# EAGLE design M2 (EAGLE 6.5.0)
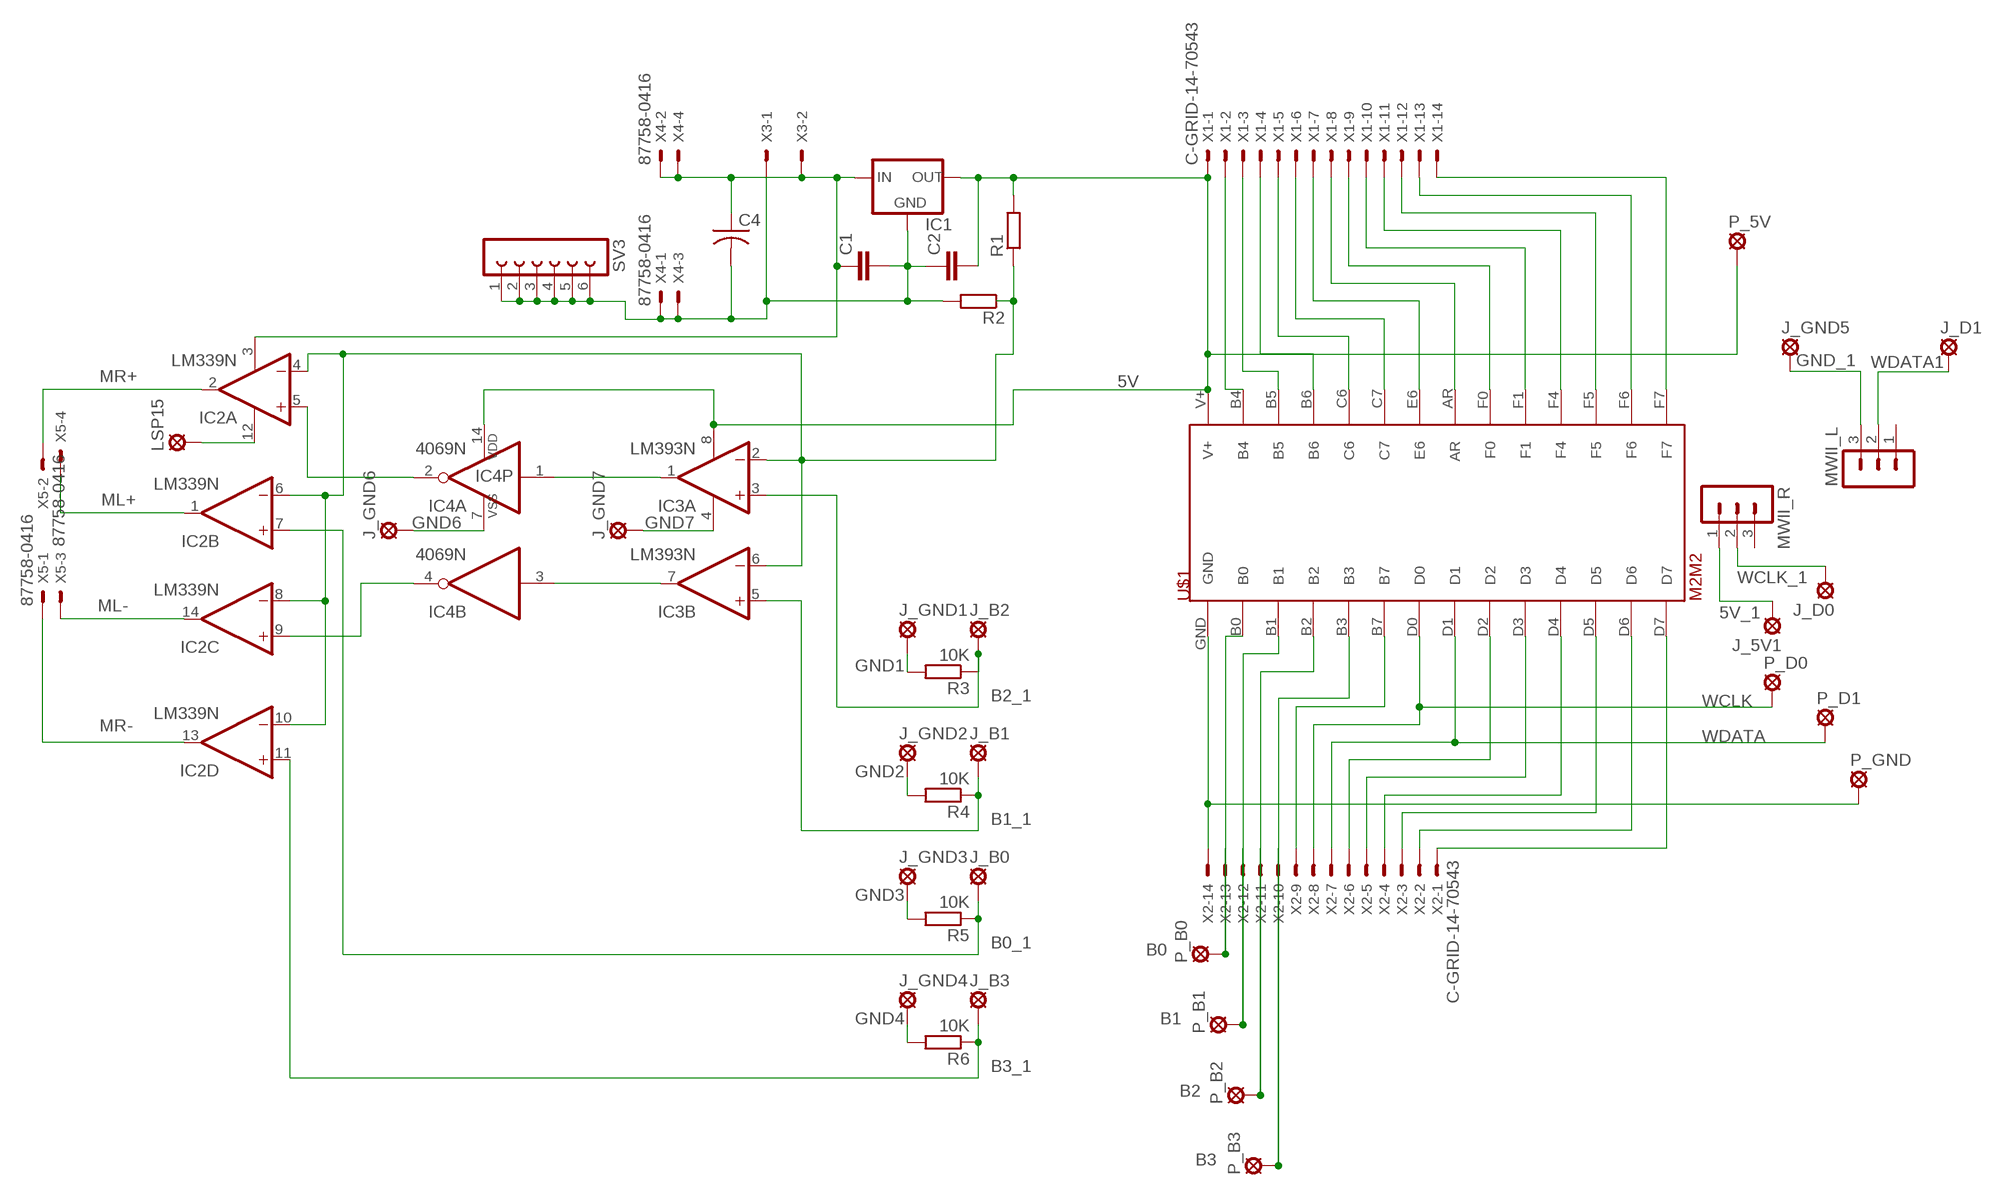
[diagram p0: schematic, sheet 1]

## Parts
C1  C2,5-3  [C2.5-3]
C2  C2,5-3  [C2.5-3]
C4  C-US050-025X075  [C050-025X075]
IC1  78MXXS  [78MXXS]
IC2  LM339N  [DIL14]
IC3  LM393N  [DIL08]
IC4  4069N  [DIL14]
J_5V1  LSP10  [LSP10]
J_B0  LSP10  [LSP10]
J_B1  LSP10  [LSP10]
J_B2  LSP10  [LSP10]
J_B3  LSP10  [LSP10]
J_D0  LSP10  [LSP10]
J_D1  LSP10  [LSP10]
J_GND1  LSP10  [LSP10]
J_GND2  LSP10  [LSP10]
J_GND3  LSP10  [LSP10]
J_GND4  LSP10  [LSP10]
J_GND5  LSP10  [LSP10]
J_GND6  LSP10  [LSP10]
J_GND7  LSP10  [LSP10]
LSP15  LSP10  [LSP10]
MWII_L  MA03-1  [MA03-1]
MWII_R  MA03-1  [MA03-1]
P_5V  LSP10  [LSP10]
P_B0  LSP10  [LSP10]
P_B1  LSP10  [LSP10]
P_B2  LSP10  [LSP10]
P_B3  LSP10  [LSP10]
P_D0  LSP10  [LSP10]
P_D1  LSP10  [LSP10]
P_GND  LSP10  [LSP10]
R1  R-EU_0204/7  [0204/7]
R2  R-EU_0204/7  [0204/7]
R3  10K  R-EU_0204/7  [0204/7]
R4  10K  R-EU_0204/7  [0204/7]
R5  10K  R-EU_0204/7  [0204/7]
R6  10K  R-EU_0204/7  [0204/7]
SV3  FE06-1  [FE06]
U$1  M2M2  [M2]
X1  C-GRID-14-70543  [70543-14]
X2  C-GRID-14-70543  [70543-14]
X3  KK-156-2  [KK-156-2]
X4  87758-0416  [87758-0416]
X5  87758-0416  [87758-0416]

## Nets
5V: C2.2 IC1.OUT IC3.8(P:V+) IC4.14(P:VDD) P_5V.MP R1.2 U$1.V+ X1.1
5V_1: J_5V1.MP MWII_R.1
B0 [POWER]: P_B0.MP U$1.B0 X2.13
B0_1 [POWER]: IC2.7(B:+IN) J_B0.MP R5.1
B1 [POWER]: P_B1.MP U$1.B1 X2.12
B1_1 [POWER]: IC3.5(B:+IN) J_B1.MP R4.1
B2 [POWER]: P_B2.MP U$1.B2 X2.11
B2_1 [POWER]: IC3.3(A:+IN) J_B2.MP R3.1
B3 [POWER]: P_B3.MP U$1.B3 X2.10
B3_1 [POWER]: IC2.11(D:+IN) J_B3.MP R6.1
GND1: J_GND1.MP R3.2
GND2: J_GND2.MP R4.2
GND3: J_GND3.MP R5.2
GND4: J_GND4.MP R6.2
GND6: IC4.7(P:VSS) J_GND6.MP
GND7: IC3.4(P:V-) J_GND7.MP
GND_1: J_GND5.MP MWII_L.3
ML+: IC2.1(B:OUT) X5.4
ML-: IC2.14(C:OUT) X5.3
MR+: IC2.2(A:OUT) X5.2
MR-: IC2.13(D:OUT) X5.1
N$2: U$1.B4 X1.2
N$3: U$1.B5 X1.3
N$4: U$1.B6 X1.4
N$5: U$1.C6 X1.5
N$6: U$1.C7 X1.6
N$7: U$1.E6 X1.7
N$8: U$1.AR X1.8
N$9: U$1.F0 X1.9
N$10: U$1.F1 X1.10
N$11: U$1.F4 X1.11
N$12: U$1.F5 X1.12
N$13: U$1.F6 X1.13
N$15: U$1.F7 X1.14
N$16: IC2.4(A:-IN) IC2.6(B:-IN) IC2.8(C:-IN) IC2.10(D:-IN) IC3.2(A:-IN) IC3.6(B:-IN) R1.1 R2.1
N$17 [POWER]: P_GND.MP U$1.GND X2.14
N$21: U$1.B7 X2.9
N$24: U$1.D2 X2.6
N$25: U$1.D3 X2.5
N$26: U$1.D4 X2.4
N$27: U$1.D5 X2.3
N$28: U$1.D6 X2.2
N$29: U$1.D7 X2.1
N$30: IC3.1(A:OUT) IC4.1(A:I)
N$31: IC3.7(B:OUT) IC4.3(B:I)
N$33: IC2.5(A:+IN) IC4.2(A:O)
N$34 [POWER]: C1.1 C4.1 IC1.IN IC2.3(P:V+) X3.2 X4.2 X4.4
N$36: IC2.9(C:+IN) IC4.4(B:O)
N$50: IC2.12(P:GND) LSP15.MP
N$51: C1.2 C2.1 C4.2 IC1.GND R2.2 SV3.1 SV3.2 SV3.3 SV3.4 SV3.5 SV3.6 X3.1 X4.1 X4.3
WCLK: P_D0.MP U$1.D0 X2.8
WCLK_1: J_D0.MP MWII_R.2
WDATA: P_D1.MP U$1.D1 X2.7
WDATA1: J_D1.MP MWII_L.2
Unconnected: IC4.5(C:I) IC4.6(C:O) IC4.8(D:O) IC4.9(D:I) IC4.10(E:O) IC4.11(E:I) IC4.12(F:O) IC4.13(F:I) MWII_L.1 MWII_R.3

## Library data of the parts
C1 C2 = capacitor-wima:C: CAPACITOR naming: grid - package width
C4 = rcl:C-US: CAPACITOR, American symbol
IC1 = v-reg:78MXXS: VOLTAGE REGULATOR
IC2 = linear:LM339: Low Power Low Offset Voltage Quad Comparators with open collector; LM139/LM239/LM339/LM2901/LM3302
IC3 = linear:LM393: COMPARATOR
IC4 = 40xx:4069: Hex INVERTER
J_5V1 J_B0 J_B1-J_B3 J_D0 J_D1 J_GND1-J_GND7 LSP15 P_5V P_B0 P_B1-P_B3 P_D0 P_D1 P_GND = solpad:LSP10: SOLDER PAD drill 1.0 mm, distributor Buerklin, 12H555
MWII_L MWII_R = con-lstb:MA03-1: PIN HEADER; OC_FARNELL: unknown; OC_NEWARK: unknown
R1-R6 = resistor:R-EU_: RESISTOR, European symbol
SV3 = con-lsta:FE06-1: FEMALE HEADER; OC_FARNELL: unknown; OC_NEWARK: unknown
U$1 = m2:M2
X1 X2 = con-molex:C-GRID-14: CONNECTOR wire to board 2.54 mm (0.100") pitch header; OC_FARNELL: unknown; OC_NEWARK: unknown
X3 = con-molex:KK-156-2: KK 156 HEADER Source: http://www.molex.com/pdm_docs/sd/026604100_sd.pdf; OC_FARNELL: unknown; OC_NEWARK: unknown
X4 X5 = con-molex:87758-0416: 4 Pin - 2mm Dual Row Single Wafer, Vertical T/H HDR Source: http://www.molex.com/pdm_docs/sd/877580616_sd.pdf; MF: FARNELL; MPN: 87758-0416; OC_FARNELL: 7472315; OC_NEWARK: 39K3681

## Net classes
0 default: width 0.406 mm, clearance 0.254 mm
1 POWER: width 0.61 mm, clearance 0.254 mm

## Board
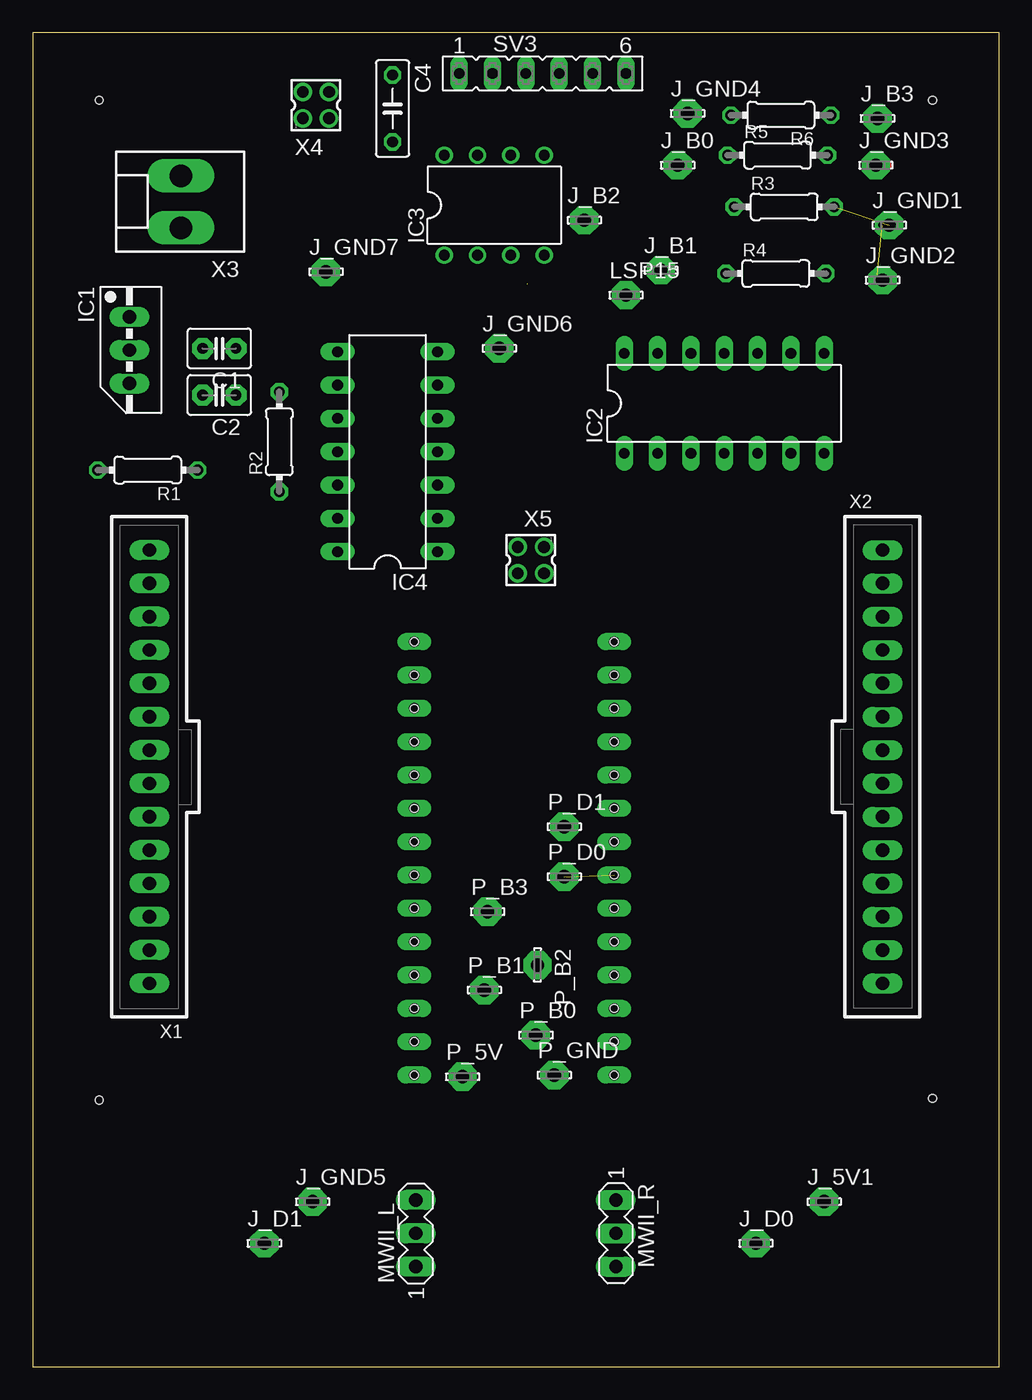
[diagram p1: board, top side]
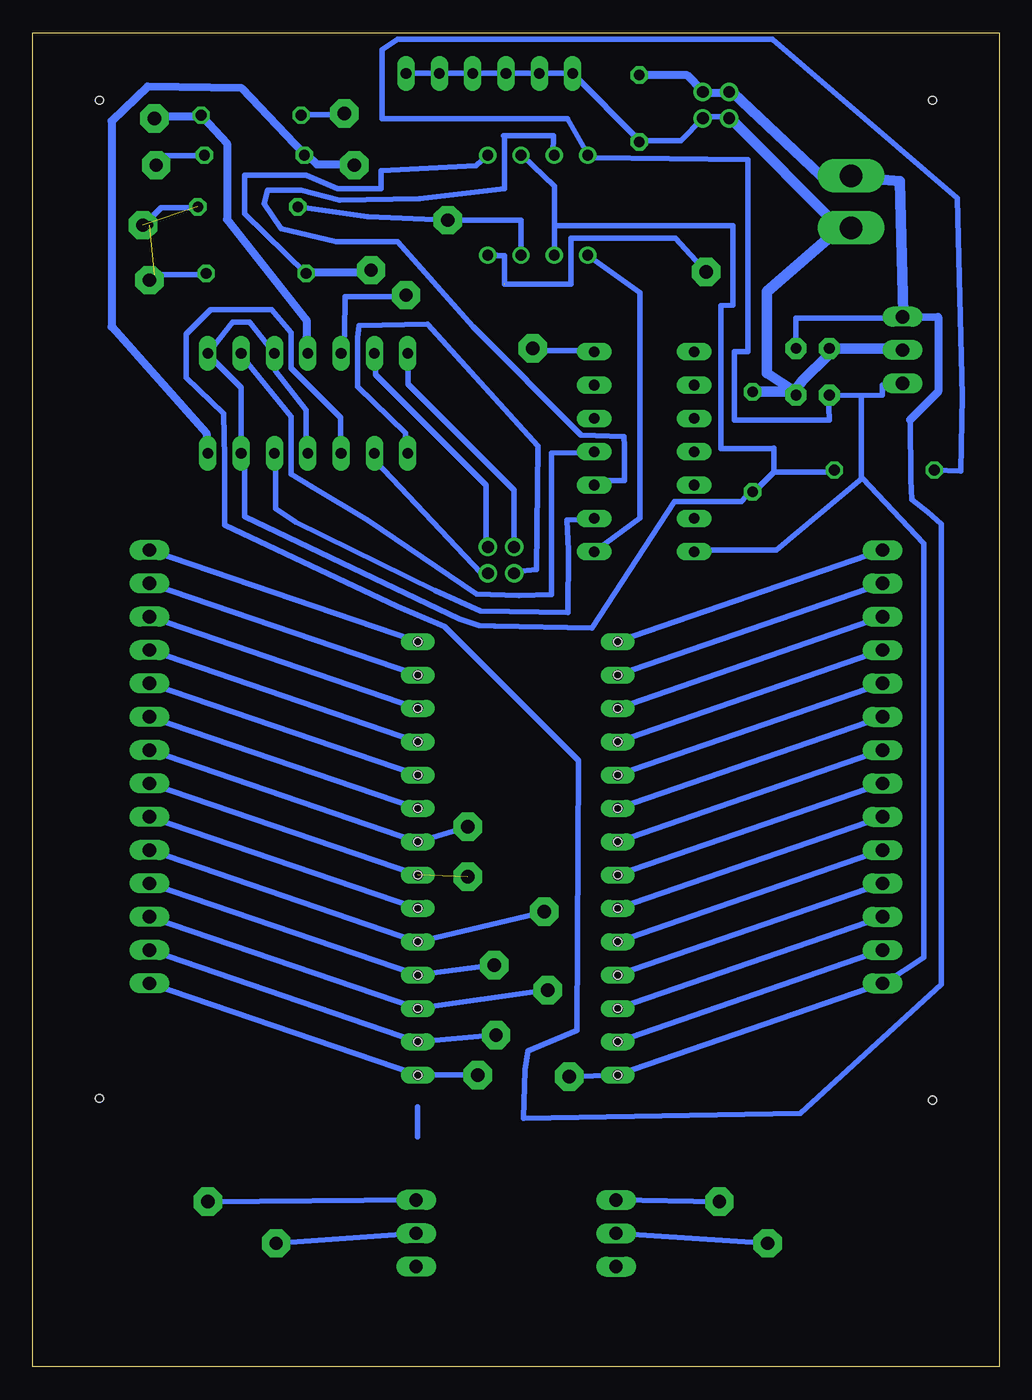
[diagram p2: board, bottom side, seen from below]

Size 73.65 x 101.65 mm. Coordinates in mm from the lower left corner, seen from the top.
Outline: 73.65,0 73.65,101.65 0,101.65 0,0 73.65,0
Copper layers (1*16): Top 0.035mm / dielectric 1.5mm / Bottom 0.035mm
Design rules "default": minimum track width 10mil, minimum drill 24mil, track to track 8mil, track to pad 8mil, pad to pad 8mil, via to via 8mil, smd to smd 8mil, copper to edge 40mil, drill to drill 8mil, minimum pad ring 10mil, minimum via ring 8mil, stop-mask expansion 4mil, vias tented up to drill 0mil, thermal gap 10mil
Holes 0.6 mm at 5.07,20.32 5.07,96.52 68.57,96.52 68.57,20.45

### Footprints (pad centres in the part's own frame; a part is rotated, then mirrored left to right if it is on the bottom)
C2.5-3 = drill 0.813 pad 1.6 octagon: 1 -1.27,0; 2 1.27,0
C050-025X075 = drill 0.813 octagon: 1 -2.54,0; 2 2.54,0
78MXXS = drill 1.016 long: GND 0,-2.54; IN -2.54,-2.54; OUT 2.54,-2.54
DIL14 = drill 0.813 long: 1 -7.62,-3.81; 2 -5.08,-3.81; 3 -2.54,-3.81; 4 0,-3.81; 5 2.54,-3.81; 6 5.08,-3.81; 7 7.62,-3.81; 8 7.62,3.81; 9 5.08,3.81; 10 2.54,3.81; 11 0,3.81; 12 -2.54,3.81; 13 -5.08,3.81; 14 -7.62,3.81
DIL08 = drill 0.813 pad 1.27: 1 -3.81,-3.81; 2 -1.27,-3.81; 3 1.27,-3.81; 4 3.81,-3.81; 5 3.81,3.81; 6 1.27,3.81; 7 -1.27,3.81; 8 -3.81,3.81
LSP10 = drill 1.016 pad 2.159 octagon: MP 0,0
MA03-1 = drill 1.016 long: 1 -2.54,0; 2 0,0; 3 2.54,0
0204/7 = drill 0.813 octagon: 1 -3.81,0; 2 3.81,0
FE06 = drill 0.813 long: 1 -6.35,0; 2 -3.81,0; 3 -1.27,0; 4 1.27,0; 5 3.81,0; 6 6.35,0
M2 = drill 0.8 long: AR 1.27,7.62; B0 -13.97,-7.62; B1 -11.43,-7.62; B2 -8.89,-7.62; B3 -6.35,-7.62; B4 -13.97,7.62; B5 -11.43,7.62; B6 -8.89,7.62; B7 -3.81,-7.62; C6 -6.35,7.62; C7 -3.81,7.62; D0 -1.27,-7.62; D1 1.27,-7.62; D2 3.81,-7.62; D3 6.35,-7.62; D4 8.89,-7.62; D5 11.43,-7.62; D6 13.97,-7.62; D7 16.51,-7.62; E6 -1.27,7.62; F0 3.81,7.62; F1 6.35,7.62; F4 8.89,7.62; F5 11.43,7.62; F6 13.97,7.62; F7 16.51,7.62; GND -16.51,-7.62; V+ -16.51,7.62 | hole 0.6: -13.97,7.62; -8.89,7.62; -6.35,7.62; 6.35,7.62; 8.89,7.62; 11.43,7.62; 13.97,7.62; 16.51,7.62; 16.51,-7.62; 13.97,-7.62; 11.43,-7.62; 8.89,-7.62; 6.35,-7.62; 3.81,-7.62; 1.27,-7.62; -1.27,-7.62; -3.81,-7.62; -6.35,-7.62; -8.89,-7.62; -11.43,-7.62; -13.97,-7.62; -16.51,-7.62; -16.51,7.62; -11.43,7.62; -3.81,7.62; -1.27,7.62; 1.27,7.62; 3.81,7.62
70543-14 = drill 1.016 long: 1 -16.51,0; 2 -13.97,0; 3 -11.43,0; 4 -8.89,0; 5 -6.35,0; 6 -3.81,0; 7 -1.27,0; 8 1.27,0; 9 3.81,0; 10 6.35,0; 11 8.89,0; 12 11.43,0; 13 13.97,0; 14 16.51,0
KK-156-2 = drill 1.7 pad 2.184 long: 1 -1.98,0; 2 1.98,0
87758-0416 = drill 0.9 pad 1.27: 1 -1,-1; 2 -1,1; 3 1,-1; 4 1,1

### Placement (x,y rotation side)
C1  14.21,77.6 180 top
C2  14.21,74.04 180 top
C4  27.42,95.89 270 top
IC1  9.9,77.47 270 top
IC2  52.7,73.41 0 top
IC3  35.17,88.52 0 top
IC4  27.04,69.72 90 top
J_5V1  60.32,12.57 0 top
J_B0  49.14,91.57 0 top
J_B1  47.87,83.57 0 top
J_B2  42.03,87.38 0 top
J_B3  64.38,95.12 0 top
J_D0  55.11,9.4 0 top
J_D1  17.64,9.4 0 top
J_GND1  65.27,87 0 top
J_GND2  64.76,82.8 0 top
J_GND3  64.25,91.57 0 top
J_GND4  49.9,95.5 0 top
J_GND5  21.33,12.57 0 top
J_GND6  35.55,77.6 0 top
J_GND7  22.34,83.44 0 top
LSP15  45.2,81.66 0 top
MWII_L  29.2,10.16 90 top
MWII_R  44.44,10.16 270 top
P_5V  32.76,22.1 0 top
P_B0  38.34,25.27 0 top
P_B1  34.41,28.7 0 top
P_B2  38.47,30.61 270 top
P_B3  34.66,34.67 0 top
P_D0  40.5,37.34 0 top
P_D1  40.5,41.15 0 top
P_GND  39.74,22.23 0 top
R1  8.75,68.33 180 top
R2  18.79,70.48 90 top
R3  57.27,88.39 0 top
R4  56.63,83.31 0 top
R5  56.76,92.33 0 top
R6  57.01,95.38 180 top
SV3  38.85,98.55 0 top
U$1  36.69,38.73 90 top
X1  8.88,45.72 90 top
X2  64.76,45.72 270 top
X3  11.29,88.77 90 top
X4  21.58,96.14 0 top
X5  37.96,61.47 180 top

### Tracks (layer width: path | path; a pad name or v marks a point on that pad's centre or on a via)
5V
  Bottom 0.406: P_5V.MP U$1.V+ X1.1 8.74,29.22 5.74,31.2 5.74,62.74 10.44,67.73 | 10.44,67.73 10.49,67.7 10.49,74 | 10.44,67.73 16.99,62.24 23.1,62.24 IC4.14 | 10.49,74 C2.2 13.03,73.97 12.93,72.19 12.93,72.14 20.18,72.14 20.18,77.34 19.17,77.34 19.17,92 19.22,92 31.03,92.13 31.19,92.29 IC3.8 31.36,92.46 32.88,95.12 47.02,95.12 47.02,100.36 45.85,101.14 17.29,101.14 3.18,89.06 2.8,73.97 2.91,68.26 R1.2 | IC1.OUT 7.42,74.79 8.9,74.79 8.9,74.05 10.49,74
5V_1
  Bottom 0.406: MWII_R.1 J_5V1.MP
B0
  Bottom 0.406: P_B0.MP U$1.B0 X2.13
B0_1
  Bottom 0.61: IC2.7 60.42,69.67 60.42,71.12 67.66,79.25 67.66,94.93 64.91,97.55 57.7,97.42 52.99,92.46 R5.1 52.66,92.29 52,91.63 49.19,91.63 J_B0.MP
B1
  Bottom 0.406: P_B1.MP U$1.B1 X2.12
B1_1
  Bottom 0.406: IC3.5 39.88,91.53 47.11,91.15 47.11,89.79 50.41,89.79 52.82,90.81 57.52,90.81 57.52,87.88 R4.1
  Bottom 0.61: 47.87,83.54 J_B1.MP 48.03,83.38 52.82,83.38 R4.1
B2
  Bottom 0.406: P_B2.MP U$1.B2 X2.11
B2_1
  Bottom 0.406: IC3.3 36.44,87.38 J_B2.MP 48.12,87.63 R3.1
  Bottom 0.61: 53.32,88.33 R3.1
B3
  Bottom 0.406: P_B3.MP U$1.B3 X2.10
B3_1
  Bottom 0.61: IC2.11 52.82,77.27 52.8,79.76 58.85,87.44 58.85,93.22 60.75,95.26 R6.1 61.08,95.26 64.38,95.26 J_B3.MP
GND1  (1 unrouted)
GND2  (via drill 0.6)  (1 unrouted)
  Bottom 0.406: 61.08,88.33 63.88,88.33 65.2,87.01 v64.76,87.01 | R4.2 60.58,83.21 64.38,83.21 64.71,82.88 J_GND2.MP
GND3
  Top 0.406: J_GND3.MP 65.27,91.57
  Bottom 0.406: R5.2 60.58,92.29 63.55,92.29 64.21,91.63 J_GND3.MP
GND4
  Top 0.406: 49.9,94.87 J_GND4.MP
  Bottom 0.406: R6.2 53.15,95.43 50.02,95.43 J_GND4.MP
GND6
  Bottom 0.406: IC4.7 30.86,77.43 35.32,77.43 35.49,77.6 J_GND6.MP
GND7  (1 unrouted)
  Bottom 0.406: J_GND7.MP 24.67,86.02 32.62,86.02 32.62,82.49 37.71,82.49 | IC3.4 38.95,84.7 38.29,84.7 38.29,84.68 37.68,84.68 37.68,82.55 37.71,82.55
GND_1
  Bottom 0.406: J_GND5.MP MWII_L.3
ML+
  Bottom 0.406: IC2.1 45.23,69.67 45.23,71.16 48.89,74.69 48.89,78.41 48.8,79.34 43.55,79.46 35.14,70.17 35.27,60.73 36.81,60.59 X5.4
ML-
  Bottom 0.406: IC2.14 45.06,77.1 45.06,74.88 36.97,66.79 36.97,62.57 X5.3
MR+
  Bottom 0.406: IC2.2 47.54,69.51 47.54,69.01 39.5,60.47 X5.2
MR-
  Bottom 0.406: IC2.13 47.54,77.1 47.54,75.6 39.12,67.18 39.12,62.57 X5.1
N$2
  Bottom 0.406: U$1.B4 X1.2
N$3
  Bottom 0.406: X1.3 U$1.B5
N$4
  Bottom 0.406: X1.4 U$1.B6
N$5
  Bottom 0.406: X1.5 U$1.C6
N$6
  Bottom 0.406: U$1.C7 X1.6
N$7
  Bottom 0.406: X1.7 U$1.E6
N$8
  Bottom 0.406: U$1.AR X1.8
N$9
  Bottom 0.406: X1.9 U$1.F0
N$10
  Bottom 0.406: U$1.F1 X1.10
N$11
  Bottom 0.406: X1.11 U$1.F4
N$12
  Bottom 0.406: U$1.F5 X1.12
N$13
  Bottom 0.406: X1.13 U$1.F6
N$15
  Bottom 0.406: U$1.F7 X1.14
N$16
  Bottom 0.406: IC2.4 52.82,69.67 52.82,72.91 55.13,75.86 55.13,77.1 IC2.10 55.3,77.27 57.12,79.59 58.44,79.59 60.25,77.27 IC2.8 60.25,77.1 57.77,74.62 IC2.6 57.48,68.75 57.52,68.75 57.52,64.77 41.14,56.97 39.64,56.46 38.46,56.43 31.04,56.3 24.73,65.91 19.64,65.91 18.98,66.7 R2.1 18.65,66.7 17.16,68.19 | 17.16,68.19 12.7,68.19 R1.1 | 34,84.86 IC3.2 33.9,86.97 33.89,86.97 | IC3.6 36.31,92.29 33.87,89.98 33.89,89.98 33.89,86.97 | 17.16,70 17.16,69.98 | 17.16,69.98 17.16,68.19 | 17.16,69.98 21.2,69.98 21.2,80.87 20.31,80.9 20.31,86.97 33.89,86.97
N$17
  Bottom 0.406: P_GND.MP U$1.GND X2.14
N$21
  Bottom 0.406: U$1.B7 X2.9
N$24
  Bottom 0.406: X2.6 U$1.D2
N$25
  Bottom 0.406: U$1.D3 X2.5
N$26
  Bottom 0.406: U$1.D4 X2.4
N$27
  Bottom 0.406: X2.3 U$1.D5
N$28
  Bottom 0.406: X2.2 U$1.D6
N$29
  Bottom 0.406: U$1.D7 X2.1
N$30
  Bottom 0.406: IC4.1 30.7,62.24 27.37,64.68 27.37,81.85 31.36,84.7 IC3.1
N$31
  Bottom 0.406: IC4.3 30.7,67.2 30.7,67.53 28.54,67.53 28.54,70.17 28.6,70.87 31.85,70.99 40.11,79.25 45.84,85.72 50.54,85.72 54.73,86.74 56.02,88.65 55.74,89.66 53.2,89.66 50.28,88.9 44.19,89.03 37.68,89.78 37.68,93.8 37.76,93.8 37.61,93.83 33.98,93.83 34,92.46 IC3.7
N$33
  Bottom 0.406: IC4.2 30.86,64.55 32.93,64.52 32.81,62.2 32.84,57.47 39.52,57.59 42.99,59.16 53.61,64.36 55.13,65.38 55.13,69.51 IC2.5
N$34
  Bottom 0.406: 50.18,69.67 50.18,72.31 53.98,76.11 53.98,78.8 55.46,80.54 60.09,80.54 61.95,78.68 61.95,75.37 59.1,72.64 59.05,69.23 59.05,64.14 45.84,57.92 42.26,56.4 32.05,46.19 32.17,25.62 35.89,24.05 36.15,22.61 36.26,18.91 15.14,19.29 4.41,29.13 4.41,64.22 5.45,65.11 6.65,66.06 6.75,67.6 6.77,72.16 | 7.58,79.91 15.48,79.91 C1.1
  Bottom 0.61: C4.1 27.4,98.4 23.76,98.4 22.61,97.24 X4.4 22.28,97.08 20.63,97.08 X4.2 20.3,97.08 | 11.38,90.81 X3.2 11.05,90.64 | 6.77,72.16 4.64,74.3 4.64,80 7.13,80.07 IC1.IN | 50.18,69.67 IC2.3 | 7.58,79.91 IC1.IN | 7.32,80.2 IC1.IN
  Bottom 0.813: 11.38,90.81 13.64,90.81 20.3,97.08 | 11.05,90.64 7.57,90.33 7.32,80.2
N$36
  Bottom 0.406: IC4.4 30.86,69.67 34.1,69.61 34.1,58.85 36.6,58.76 39.83,58.89 48.12,64.52 52.39,67.06 53.98,68.01 53.98,72.42 57.77,77.1 IC2.9
N$50
  Bottom 0.406: IC2.12 50.02,77.27 49.89,78.73 49.85,81.56 45.23,81.56 LSP15.MP
N$51
  Bottom 0.406: 15.67,74.3 15.51,74.13 C2.1 15.67,74.46 15.42,74.28 | 7.42,77.6 IC1.GND | 13.16,77.05 C1.2 | SV3.6 45.06,98.56 42.75,98.56 SV3.5 42.59,98.56 40.27,98.56 SV3.4 39.94,98.56 37.63,98.56 SV3.3 37.47,98.56 35.16,98.56 SV3.2 34.99,98.56 32.52,98.56 SV3.1 27.4,93.45 | 27.4,93.45 24.26,93.45 22.61,95.1 X4.3 22.44,95.26 20.63,95.26 X4.1 20.46,95.1 | 12.21,86.84 11.38,86.84 X3.1 | 27.4,93.45 C4.2
  Bottom 0.813: 15.67,74.3 R2.2 | C1.2 7.42,77.6 | 13.16,77.05 13.07,77.05 14.98,75.18 15.61,74.35 | 15.61,74.35 15.42,74.28 | 20.46,95.1 12.21,86.84 | 15.61,74.35 17.72,75.7 17.72,81.93 12.21,86.68 X3.1
N$55
  Bottom 0.406: 44.31,19.81 44.31,17.53
WCLK  (1 unrouted)
  Bottom 0.406: X2.8 U$1.D0
WCLK_1
  Bottom 0.406: MWII_R.2 J_D0.MP
WDATA
  Bottom 0.406: P_D1.MP U$1.D1 X2.7
WDATA1
  Bottom 0.406: J_D1.MP MWII_L.2